# Altium project Adult MCU Logic Unit.PrjPcb
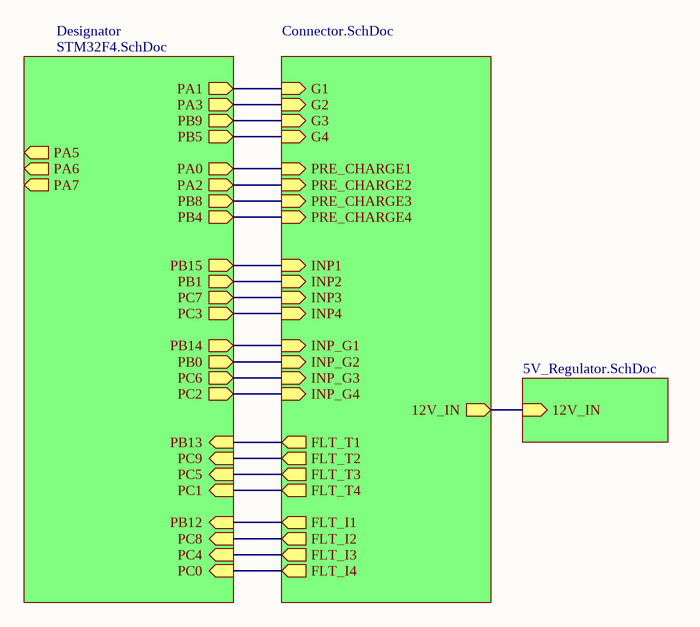
[diagram p0: Control.SchDoc]
4 sheets, 18 parts. Net scope: hierarchical (ports join the sheet entries above them; power ports are global).
Board file: Logic_Unit_1st.PcbDoc
Sheets:
  Control.SchDoc
    Designator = STM32F4.SchDoc
     = Connector.SchDoc
     = 5V_Regulator.SchDoc

## Sheet Control.SchDoc
size A4; SheetNumber: 1; SheetTotal: 4

### Sub-sheets
Designator = STM32F4.SchDoc: PC0 (in), PC1 (in), PC2 (out), PC3 (out), PC4 (in), PC5 (in), PC6 (out), PC7 (out), PC8 (in), PC9 (in), PB0 (out), PB1 (out), PB12 (in), PB13 (in), PB14 (out), PB15 (out), PA1 (out), PA0 (out), PB4 (out), PB5 (out), PB8 (out), PB9 (out), PA2 (out), PA3 (out), PA5 (out), PA6 (out), PA7 (out)
? = Connector.SchDoc: FLT_I4 (out), FLT_T4 (out), INP_G4 (in), INP4 (in), FLT_I3 (out), FLT_T3 (out), INP_G3 (in), INP3 (in), FLT_I2 (out), FLT_T2 (out), INP_G2 (in), INP2 (in), FLT_I1 (out), FLT_T1 (out), INP_G1 (in), INP1 (in), 12V_IN (out), PRE_CHARGE4 (in), G4 (in), PRE_CHARGE3 (in), G3 (in), PRE_CHARGE2 (in), G2 (in), PRE_CHARGE1 (in), G1 (in)
? = 5V_Regulator.SchDoc: 12V_IN (in)

### Nets
12V_IN: sheet /12V_IN, sheet /12V_IN
NetJ601_1: sheet Designator/PA1, sheet /G1
NetJ601_2: sheet Designator/PA0, sheet /PRE_CHARGE1
NetJ601_3: sheet Designator/PB15, sheet /INP1
NetJ601_4: sheet Designator/PB14, sheet /INP_G1
NetJ601_5: sheet Designator/PB13, sheet /FLT_T1
NetJ601_6: sheet Designator/PB12, sheet /FLT_I1
NetJ602_1: sheet Designator/PA3, sheet /G2
NetJ602_2: sheet Designator/PA2, sheet /PRE_CHARGE2
NetJ602_3: sheet Designator/PB1, sheet /INP2
NetJ602_4: sheet Designator/PB0, sheet /INP_G2
NetJ602_5: sheet Designator/PC9, sheet /FLT_T2
NetJ602_6: sheet Designator/PC8, sheet /FLT_I2
NetJ603_1: sheet Designator/PB9, sheet /G3
NetJ603_2: sheet Designator/PB8, sheet /PRE_CHARGE3
NetJ603_3: sheet Designator/PC7, sheet /INP3
NetJ603_4: sheet Designator/PC6, sheet /INP_G3
NetJ603_5: sheet Designator/PC5, sheet /FLT_T3
NetJ603_6: sheet Designator/PC4, sheet /FLT_I3
NetJ604_1: sheet Designator/PB5, sheet /G4
NetJ604_2: sheet Designator/PB4, sheet /PRE_CHARGE4
NetJ604_3: sheet Designator/PC3, sheet /INP4
NetJ604_4: sheet Designator/PC2, sheet /INP_G4
NetJ604_5: sheet Designator/PC1, sheet /FLT_T4
NetJ604_6: sheet Designator/PC0, sheet /FLT_I4

## Sheet STM32F4.SchDoc
size A4; SheetNumber: 2; SheetTotal: 4
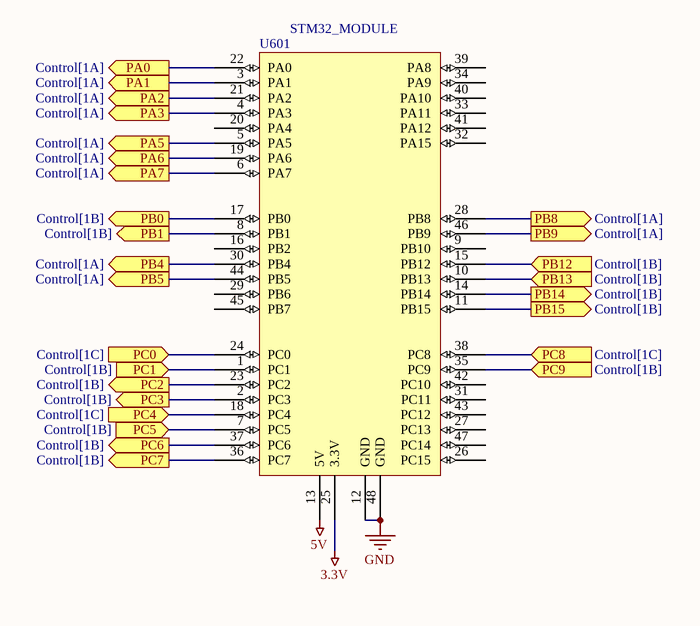
[diagram p1: STM32F4.SchDoc]

### Parts
U601  STM32_MODULE  [DIP_STM32_MODULE]

### Ports
PA0 (out, see Control[1A]), PA1 (out, see Control[1A]), PA2 (out, see Control[1A]), PA3 (out, see Control[1A]), PA5 (out, see Control[1A]), PA6 (out, see Control[1A]), PA7 (out, see Control[1A]), PB0 (out, see Control[1B]), PB1 (out, see Control[1B]), PB4 (out, see Control[1A]), PB5 (out, see Control[1A]), PB8 (out, see Control[1A]), PB9 (out, see Control[1A]), PB12 (in, see Control[1B]), PB13 (in, see Control[1B]), PB14 (out, see Control[1B]), PB15 (out, see Control[1B]), PC0 (in, see Control[1C]), PC1 (in, see Control[1B]), PC2 (out, see Control[1B]), PC3 (out, see Control[1B]), PC4 (in, see Control[1C]), PC5 (in, see Control[1B]), PC6 (out, see Control[1B]), PC7 (out, see Control[1B]), PC8 (in, see Control[1C]), PC9 (in, see Control[1B])

### Nets
3.3V: U601.25(3.3V)
5V: U601.13(5V)
GND: U601.12(GND) U601.48(GND)
NetJ601_1: U601.3(PA1) ; port PA1
NetJ601_2: U601.22(PA0) ; port PA0
NetJ601_3: U601.11(PB15) ; port PB15
NetJ601_4: U601.14(PB14) ; port PB14
NetJ601_5: U601.10(PB13) ; port PB13
NetJ601_6: U601.15(PB12) ; port PB12
NetJ602_1: U601.4(PA3) ; port PA3
NetJ602_2: U601.21(PA2) ; port PA2
NetJ602_3: U601.8(PB1) ; port PB1
NetJ602_4: U601.17(PB0) ; port PB0
NetJ602_5: U601.35(PC9) ; port PC9
NetJ602_6: U601.38(PC8) ; port PC8
NetJ603_1: U601.46(PB9) ; port PB9
NetJ603_2: U601.28(PB8) ; port PB8
NetJ603_3: U601.36(PC7) ; port PC7
NetJ603_4: U601.37(PC6) ; port PC6
NetJ603_5: U601.7(PC5) ; port PC5
NetJ603_6: U601.18(PC4) ; port PC4
NetJ604_1: U601.44(PB5) ; port PB5
NetJ604_2: U601.30(PB4) ; port PB4
NetJ604_3: U601.2(PC3) ; port PC3
NetJ604_4: U601.23(PC2) ; port PC2
NetJ604_5: U601.1(PC1) ; port PC1
NetJ604_6: U601.24(PC0) ; port PC0
NetU601_5: U601.5(PA5) ; port PA5
NetU601_6: U601.6(PA7) ; port PA7
NetU601_19: U601.19(PA6) ; port PA6

Not connected (* = marked no-connect by the designer): U601 9(PB10) 16(PB2) 20(PA4) 26(PC15) 27(PC13) 29(PB6) 31(PC11) 32(PA15) 33(PA11) 34(PA9) 39(PA8) 40(PA10) 41(PA12) 42(PC10) 43(PC12) 45(PB7) 47(PC14)

### Library data of the parts
U601 = CMP-021-000010-1: processor; Source: robit_ic.SchLib; Design Item ID: STM32_MODULE

## Sheet Connector.SchDoc
size A4; SheetNumber: 4; SheetTotal: 4
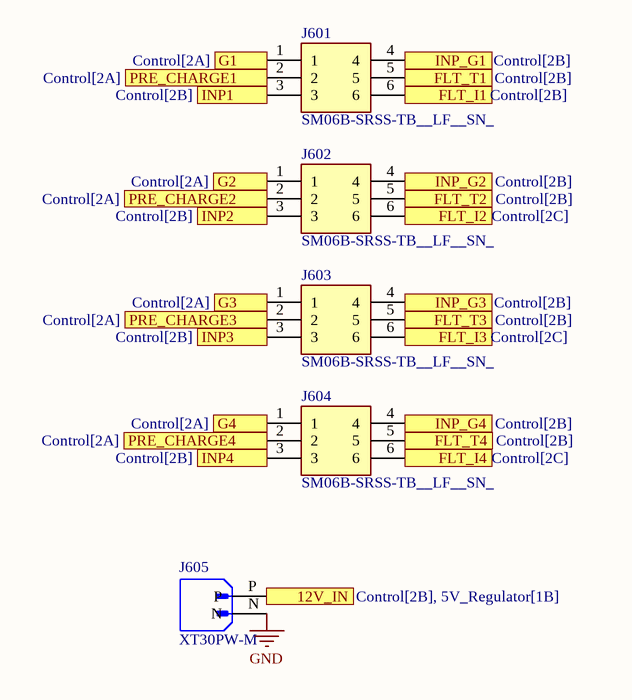
[diagram p2: Connector.SchDoc]

### Parts
J601  SM06B-SRSS-TB__LF__SN_  [SM06B-SRSS-TB]
J602  SM06B-SRSS-TB__LF__SN_  [SM06B-SRSS-TB]
J603  SM06B-SRSS-TB__LF__SN_  [SM06B-SRSS-TB]
J604  SM06B-SRSS-TB__LF__SN_  [SM06B-SRSS-TB]
J605  XT30PW-M  [AMASS_XT30PW-M]

### Ports
12V_IN (out, see Control[2B], 5V_Regulator[1B]), FLT_I1 (out, see Control[2B]), FLT_I2 (out, see Control[2C]), FLT_I3 (out, see Control[2C]), FLT_I4 (out, see Control[2C]), FLT_T1 (out, see Control[2B]), FLT_T2 (out, see Control[2B]), FLT_T3 (out, see Control[2B]), FLT_T4 (out, see Control[2B]), G1 (in, see Control[2A]), G2 (in, see Control[2A]), G3 (in, see Control[2A]), G4 (in, see Control[2A]), INP1 (in, see Control[2B]), INP2 (in, see Control[2B]), INP3 (in, see Control[2B]), INP4 (in, see Control[2B]), INP_G1 (in, see Control[2B]), INP_G2 (in, see Control[2B]), INP_G3 (in, see Control[2B]), INP_G4 (in, see Control[2B]), PRE_CHARGE1 (in, see Control[2A]), PRE_CHARGE2 (in, see Control[2A]), PRE_CHARGE3 (in, see Control[2A]), PRE_CHARGE4 (in, see Control[2A])

### Nets
GND: J605.N
12V_IN: J605.P ; port 12V_IN
NetJ601_1: J601.1 ; port G1
NetJ601_2: J601.2 ; port PRE_CHARGE1
NetJ601_3: J601.3 ; port INP1
NetJ601_4: J601.4 ; port INP_G1
NetJ601_5: J601.5 ; port FLT_T1
NetJ601_6: J601.6 ; port FLT_I1
NetJ602_1: J602.1 ; port G2
NetJ602_2: J602.2 ; port PRE_CHARGE2
NetJ602_3: J602.3 ; port INP2
NetJ602_4: J602.4 ; port INP_G2
NetJ602_5: J602.5 ; port FLT_T2
NetJ602_6: J602.6 ; port FLT_I2
NetJ603_1: J603.1 ; port G3
NetJ603_2: J603.2 ; port PRE_CHARGE3
NetJ603_3: J603.3 ; port INP3
NetJ603_4: J603.4 ; port INP_G3
NetJ603_5: J603.5 ; port FLT_T3
NetJ603_6: J603.6 ; port FLT_I3
NetJ604_1: J604.1 ; port G4
NetJ604_2: J604.2 ; port PRE_CHARGE4
NetJ604_3: J604.3 ; port INP4
NetJ604_4: J604.4 ; port INP_G4
NetJ604_5: J604.5 ; port FLT_T4
NetJ604_6: J604.6 ; port FLT_I4

### Library data of the parts
J601-J604 = SM06B-SRSS-TB__LF__SN_: Connector; Manufacturer_Name: JST (JAPAN SOLDERLESS TERMINALS); Manufacturer_Part_Number: SM06B-SRSS-TB (LF)(SN); Datasheet Link: http://uk.rs-online.com/web/p/products/5468827
J605 = CMP-019-000079-2: Socket; DC supply; XT30; male; PIN: 2; on PCBs; THT; Colour: yellow; System: Connector; MF: AMASS; Check_prices: https://www.snapeda.com/parts/XT30PW-M/AMASS/view-part/?ref=eda; Source: XT30PW-M.SchLib; Pin Count: 2; Value: *; Package: None; Component Type: Standard; SnapEDA_Link: https://www.snapeda.com/parts/XT30PW-M/AMASS/view-part/?ref=snap; MP: XT30PW-M; Design Item ID: XT30PW-M

## Sheet 5V_Regulator.SchDoc
size A4; SheetNumber: 3; SheetTotal: 4
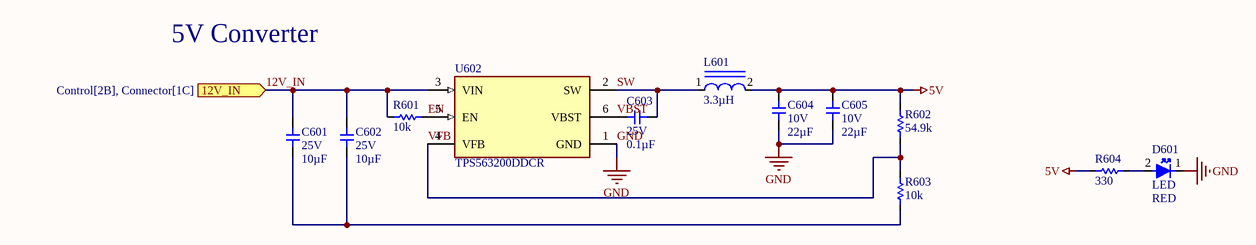
[diagram p3: 5V_Regulator.SchDoc]

### Parts
C601  Voltage: 25V  Capacitance: 10µF  [0805]  (hidden comment: non-polar_Capacitor)
C602  Voltage: 25V  Capacitance: 10µF  [0805]  (hidden comment: non-polar_Capacitor)
C603  Voltage: 25V  Capacitance: 0.1µF  [0805]  (hidden comment: non-polar_Capacitor)
C604  Voltage: 10V  Capacitance: 22µF  [0805]  (hidden comment: non-polar_Capacitor)
C605  Voltage: 10V  Capacitance: 22µF  [0805]  (hidden comment: non-polar_Capacitor)
D601  LED  Color: RED  [SMD_LED]
L601  Inductance: 3.3µH  [FP-SRP7030CA-MFG]  (hidden comment: inductor_SRP7030CA)
R601  Resistance: 10k  [0805]  (hidden comment: Resistor)
R602  Resistance: 54.9k  [0805]  (hidden comment: Resistor)
R603  Resistance: 10k  [0805]  (hidden comment: Resistor)
R604  Resistance: 330  [SMD_Resistor]  (hidden comment: Resistor)
U602  TPS563200DDCR  [FP-DDC0006A-MFG]

### Ports
12V_IN (in, see Control[2B], Connector[1C])

### Nets
5V: C604.2 C605.2 L601.2 R602.2 R604.1
GND: C604.1 C605.1 D601.1 U602.1(GND)
12V_IN: C601.2 C602.2 R601.1 U602.3(VIN) ; port 12V_IN
EN: R601.2 U602.5(EN)
SW: C603.2 L601.1 U602.2(SW)
VBST: C603.1 U602.6(VBST)
VFB: R602.1 R603.2 U602.4(VFB)
NetC601_1: C601.1 C602.1 R603.1
NetD601_2: D601.2 R604.2

### Notes on the sheet
- 5V Converter

### Library data of the parts
C601-C605 = CMP-024-000020-15: SMD type ceramic capacitor; Design Item ID: Capacitor; Source: robit_passive.SchLib
D601 = CMP-026-000008-1: Light Emitting Diode; Design Item ID: LED; Source: robit_passive.SchLib
L601 = CMP-028-000006-1: General Purpose Inductor, 6.8uH, 20%, 1 Element, Powdered Metal Alloy-Core, SMD, 3130
R601-R603 = CMP-029-000004-8: SMD type resistor; Design Item ID: Resistor; Source: robit_passive.SchLib
R604 = CMP-029-000004-1: SMD type resistor; Design Item ID: Resistor; Source: robit_passive.SchLib
U602 = CMP-04918-000155-1: IC REG BUCK ADJ 3A TSOT23-6; Quiescent Current: 190uA; Output Voltage: 7V; Min Input Voltage: 4.5V; Output Configuration: Positive; Number of Outputs: 1; Switching Frequency: 650kHz; Synchronous Rectifier: Yes; Min Output Voltage: 760mV; Output Type: Adjustable; Operating Supply Voltage: 17V; Max Operating Temperature: 125°C; Lead Free: Lead Free; Packaging: Tape and Reel; Radiation Hardening: No; Mount: Surface Mount; Contact Plating: Tin; Output Current: 3A; Max Output Voltage: 7V; Min Operating Temperature: -40°C; Case/Package: SOT-23-6; Max Output Current: 3A; Max Input Voltage: 17V

## Nets that join several sheets
5V: STM32F4 (U601.13), 5V_Regulator (5 pins)
GND: STM32F4 (U601.12 U601.48), Connector (J605.N), 5V_Regulator (C604.1 C605.1 D601.1 U602.1)
12V_IN: Connector (J605.P), 5V_Regulator (C601.2 C602.2 R601.1 U602.3)
NetJ601_1: STM32F4 (U601.3), Connector (J601.1)
NetJ601_2: STM32F4 (U601.22), Connector (J601.2)
NetJ601_3: STM32F4 (U601.11), Connector (J601.3)
NetJ601_4: STM32F4 (U601.14), Connector (J601.4)
NetJ601_5: STM32F4 (U601.10), Connector (J601.5)
NetJ601_6: STM32F4 (U601.15), Connector (J601.6)
NetJ602_1: STM32F4 (U601.4), Connector (J602.1)
NetJ602_2: STM32F4 (U601.21), Connector (J602.2)
NetJ602_3: STM32F4 (U601.8), Connector (J602.3)
NetJ602_4: STM32F4 (U601.17), Connector (J602.4)
NetJ602_5: STM32F4 (U601.35), Connector (J602.5)
NetJ602_6: STM32F4 (U601.38), Connector (J602.6)
NetJ603_1: STM32F4 (U601.46), Connector (J603.1)
NetJ603_2: STM32F4 (U601.28), Connector (J603.2)
NetJ603_3: STM32F4 (U601.36), Connector (J603.3)
NetJ603_4: STM32F4 (U601.37), Connector (J603.4)
NetJ603_5: STM32F4 (U601.7), Connector (J603.5)
NetJ603_6: STM32F4 (U601.18), Connector (J603.6)
NetJ604_1: STM32F4 (U601.44), Connector (J604.1)
NetJ604_2: STM32F4 (U601.30), Connector (J604.2)
NetJ604_3: STM32F4 (U601.2), Connector (J604.3)
NetJ604_4: STM32F4 (U601.23), Connector (J604.4)
NetJ604_5: STM32F4 (U601.1), Connector (J604.5)
NetJ604_6: STM32F4 (U601.24), Connector (J604.6)